# Altium schematic sheet POS12V.SchDoc
size B
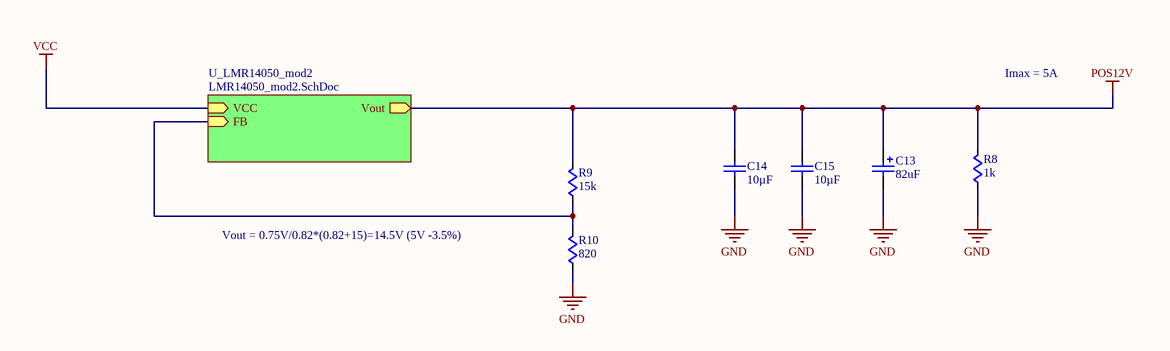
[diagram p0: POS12V.SchDoc]

## Parts
C13  value 82uF  [CAP_EEFK_D8]  (hidden comment: EEEFK1V680XP)
C14  value 10µF  [C0805]  (hidden comment: Cap)
C15  value 10µF  [C0805]  (hidden comment: Cap)
R8  value 1k  [R0805]  (hidden comment: Res)
R9  value 15k  [R0805]  (hidden comment: Res)
R10  value 820  [R0805]  (hidden comment: Res)

## Sub-sheets
U_LMR14050_mod2 = LMR14050_mod2.SchDoc: VCC (in), Vout (out), FB (in)

## Nets
GND: C13.2 C14.1 C15.1 R8.1 R10.1
POS12V: C13.1 C14.2 C15.2 R8.2 R9.2 ; sheet U_LMR14050_mod2/Vout
VCC: sheet U_LMR14050_mod2/VCC
NetR9_1: R9.1 R10.2 ; sheet U_LMR14050_mod2/FB

## Notes on the sheet
- Imax = 5A
- Vout = 0.75V/0.82*(0.82+15)=14.5V (5V -3.5%)

## Library data of the parts
C13 = EEEFK1V680XP: Polarized Capacitor (Surface Mount); Vendor: Panasonic; Built_By: EMA_UL_Team; C: Copyright (C) 2015 Accelerated Designs. All rights reserved; Manufacturer_Part_Number: EEEFK1V680XP; Supplier 1: Digi-Key; Supplier Part Number 1: P18960DKR-ND
C14 C15 = Cap: capacitor
R8-R10 = Res: resistor